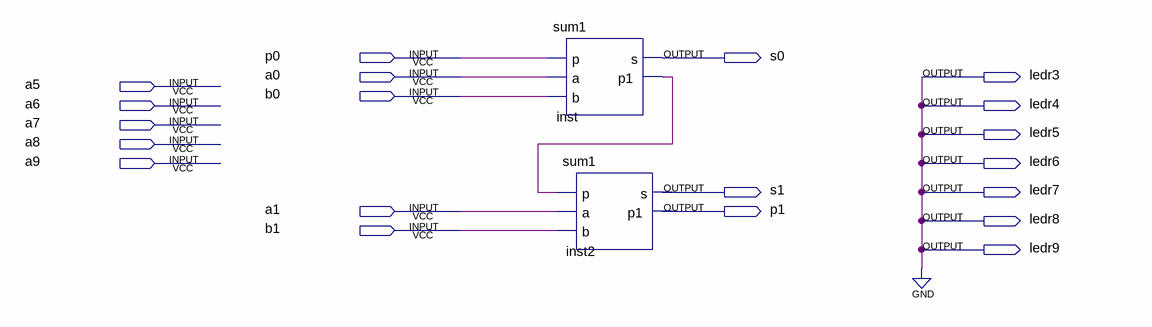
[diagram p0: schematic sheet]
// Quartus schematic sum2.bdf as structural Verilog: 2 symbols, 20 pins
module sum2 (
  input  p0,
  input  a0,
  input  a5,
  input  b0,
  input  a6,
  input  a7,
  input  a8,
  input  a9,
  input  a1,
  input  b1,
  output s0,
  output ledr3,
  output ledr4,
  output ledr5,
  output ledr6,
  output s1,
  output ledr7,
  output p1,
  output ledr8,
  output ledr9
);

  wire inst_p1;

  sum1 inst (.p(p0), .a(a0), .b(b0), .s(s0), .p1(inst_p1));
  sum1 inst2 (.p(inst_p1), .a(a1), .b(b1), .s(s1), .p1(p1));

  assign ledr3 = 1'b0;
  assign ledr4 = 1'b0;
  assign ledr5 = 1'b0;
  assign ledr6 = 1'b0;
  assign ledr7 = 1'b0;
  assign ledr8 = 1'b0;
  assign ledr9 = 1'b0;
endmodule
